# Altium schematic sheet Power.SchDoc
size B; SheetNumber: 3; SheetTotal: 12
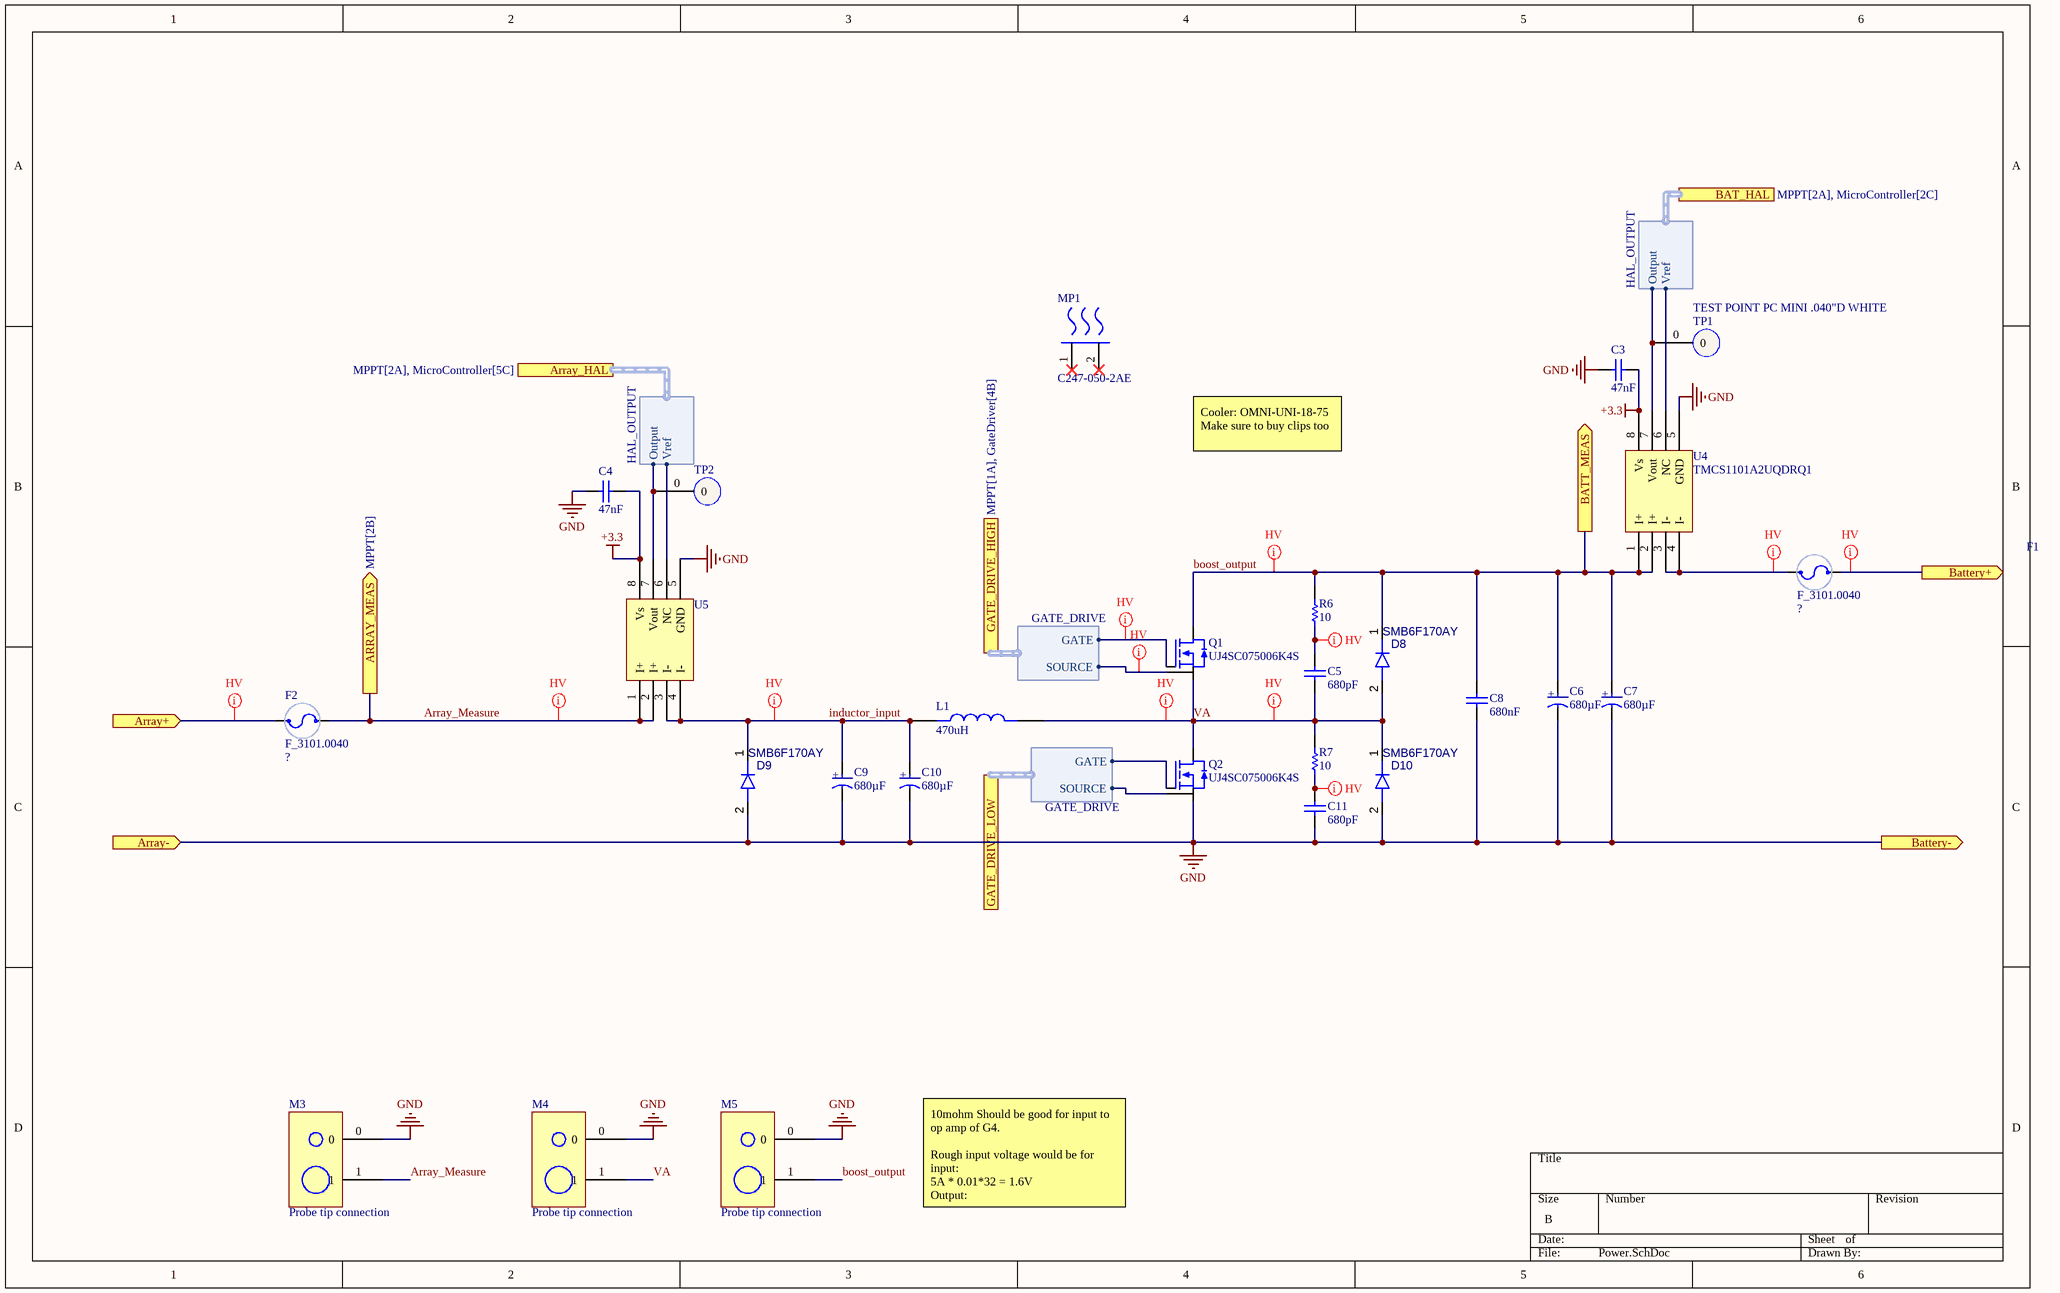
[diagram p0: Power.SchDoc]

## Parts
C3  value 47nF  [0603_CAPACITOR]  (hidden comment: C0603C473K4RECAUTO)
C4  value 47nF  [0603_CAPACITOR]  (hidden comment: C0603C473K4RECAUTO)
C5  value 680pF  [0805_Capacitor]  (hidden comment: C0805C681K2RAC7800)
C6  value 680µF  [381LR681M200J032-Footprint-1]  (hidden comment: 381LR681M200K022)
C7  value 680µF  [381LR681M200J032-Footprint-1]  (hidden comment: 381LR681M200K022)
C8  value 680nF  [684MMR400K-Footprint-1]  (hidden comment: 684MMR400K)
C9  value 680µF  [381LR681M200J032-Footprint-1]  (hidden comment: 381LR681M200K022)
C10  value 680µF  [381LR681M200J032-Footprint-1]  (hidden comment: 381LR681M200K022)
C11  value 680pF  [0805_Capacitor]  (hidden comment: C0805C681K2RAC7800)
D8  SMB6F170AY  [SMB6F170AY-Footprint-1]
D9  SMB6F170AY  [SMB6F170AY-Footprint-1]
D10  SMB6F170AY  [SMB6F170AY-Footprint-1]
F1  F_3101.0040  [F_FPG4]
F2  F_3101.0040  [F_FPG4]
L1  value 470uH  [ATCA-08-471M-H-Footprint-1]  (hidden comment: ATCA-08-471M-H)
M3  Probe tip connection  [Probe tip connection-Footprint-1]
M4  Probe tip connection  [Probe tip connection-Footprint-1]
M5  Probe tip connection  [Probe tip connection-Footprint-1]
MP1  C247-050-2AE  [FP-C247-050-2AE-MFG]
Q1  UJ4SC075006K4S  [T_TO_247_4L_UNITEDSIC - Vertical]
Q2  UJ4SC075006K4S  [T_TO_247_4L_UNITEDSIC - Vertical]
R6  value 10  [1210_Resistor]  (hidden comment: Resistor 1210 10 ohm 1%)
R7  value 10  [1210_Resistor]  (hidden comment: Resistor 1210 10 ohm 1%)
TP1  TEST POINT PC MINI .040"D WHITE  [TEST POINT 0.040" WHITE]
TP2  TEST POINT PC MINI .040"D WHITE  [TEST POINT 0.040" WHITE]  (value not drawn)
U4  TMCS1101A2UQDRQ1  [SOIC127P610X173-8N]
U5  TMCS1101A2UQDRQ1  [SOIC127P610X173-8N]  (value not drawn)

## Ports
Array+ (in, see MPPT[1B]), Array- (in, see MPPT[1B]), Array_HAL (harness HAL_OUTPUT, see MPPT[2A], MicroController[5C]), ARRAY_MEAS (out, see MPPT[2B]), BAT_HAL (harness HAL_OUTPUT, see MPPT[2A], MicroController[2C]), BATT_MEAS (out, see MPPT[2B]), Battery+ (out, see MPPT[2B]), Battery- (out, see MPPT[2B]), GATE_DRIVE_HIGH (harness GATE_DRIVE, see MPPT[1A], GateDriver[4B]), GATE_DRIVE_LOW (harness GATE_DRIVE, see MPPT[1A], GateDriver[4C])

## Harnesses
GATE_DRIVE: GATE, SOURCE
HAL_OUTPUT: Vref, Output

## Nets
+3.3: C3.2 C4.2 U4.8(Vs) U5.8(Vs)
GND: C3.1 C4.1 C6.1 C7.1 C8.1 C9.1 C10.1 C11.1 D9.2(A) D10.2(A) M3.0 M4.0 M5.0 Q2.2(S) U4.5(GND) U5.5(GND) ; port Array-, port Battery-
Array+: F2.1 ; port Array+
Array_Measure: F2.2 M3.1 U5.1(I+) U5.2(I+) ; port ARRAY_MEAS
Battery+: F1.2 ; port Battery+
boost_output: C6.2 C7.2 C8.2 D8.1(K) M5.1 Q1.1(D) R6.2 U4.1(I+) U4.2(I+) ; port BATT_MEAS
inductor_input: C9.2 C10.2 D9.1(K) L1.1 U5.3(I-) U5.4(I-)
VA: C5.1 D8.2(A) D10.1(K) L1.2 M4.1 Q1.2(S) Q2.1(D) R7.2
NetC5_2: C5.2 R6.1
NetC11_2: C11.2 R7.1
NetF1_1: F1.1 U4.3(I-) U4.4(I-)
NetQ1_3: Q1.3(K) ; port GATE_DRIVE_HIGH.SOURCE
NetQ1_4: Q1.4(G) ; port GATE_DRIVE_HIGH.GATE
NetQ2_3: Q2.3(K) ; port GATE_DRIVE_LOW.SOURCE
NetQ2_4: Q2.4(G) ; port GATE_DRIVE_LOW.GATE
NetTP1_0: TP1.0 U4.7(Vout) ; port BAT_HAL.Output
NetTP2_0: TP2.0 U5.7(Vout) ; port Array_HAL.Output
NetU4_6: U4.6(NC) ; port BAT_HAL.Vref
NetU5_6: U5.6(NC) ; port Array_HAL.Vref

Not connected (* = marked no-connect by the designer): MP1 1(MNT_1)* 2(MNT_2)*

## Layout directives
net class HV: Array+, Array_Measure, Battery+, boost_output, inductor_input, NetC5_2, NetC11_2, NetF1_1, NetQ1_3, NetQ1_4, VA

## Notes on the sheet
- Cooler: OMNI-UNI-18-75
  Make sure to buy clips too
- 10mohm Should be good for input to op amp of G4.
  Rough input voltage would be for input:
  5A * 0.01*32 = 1.6V
  Output:
  2A * 0.01*64 = 1.28
- (in symbol CMP-001-00126-3) +

## Library data of the parts
C3 C4 = CMP-001-00133-1: Ceramic Capacitor, Multilayer, Ceramic, 16V, 10% +Tol, 10% -Tol, X7R, 15% TC, 0.047uF, Surface Mount, 0603; Mounting Technology: SMD; Tolerance: 10%; Capacitor Type: Ceramic; Case/Package: 0603; Voltage Rating: 16V
C5 C11 = CMP-001-00128-1: Ceramic Capacitor, Multilayer, Ceramic, 200V, 10% +Tol, 10% -Tol, X7R, -/+15ppm/Cel TC, 0.00068uF, 0805; Case/Package: 0805; Pins: 2; Min Operating Temperature: -55°C; Capacitor Type: Ceramic; Max Operating Temperature: 125°C; Mounting Technology: SMD; Tolerance: 10%; Voltage Rating: 200V
C6 C7 C9 C10 = CMP-001-00126-3: Aluminum Electrolytic Capacitor, Polarized, Aluminum (wet), 200V, 20% +Tol, 20% -Tol, 680uF, Through Hole Mount; Ripple Current (AC): 3.45A; Capacitor Type: Aluminium; Ripple Current: 2.42A; Case/Package: Can; Mounting Technology: TH; Voltage Rating: 200V; Tolerance: 20%; Pins: 2; Min Operating Temperature: -40°C; Max Operating Temperature: 105°C
C8 = CMP-001-00127-2: Film Capacitor, Polyester, 400V, 10% +Tol, 10% -Tol, 0.68uF, Through Hole Mount; Voltage Rating: 200V; Tolerance: 10%; Max Operating Temperature: 85°C; Mounting Technology: TH; Case/Package: Bulk; Min Operating Temperature: -55°C; Pins: 2; Capacitor Type: FILM
D8-D10 = CMP-004-00044-1: TVS Diodes / ESD Suppressors Automotive 600 W, 170 V TVS in SMB Flat; Peak Inverse Voltage: 170V; Max Surge Current: 2.2A; Pins: 2; Min Operating Temperature: -55°C; Mounting Technology: SMD; Max Operating Temperature: 175°C; Case/Package: SMBflat; RoHS Compliant: Yes
F1 F2 = CMP-047-000004-2: Fuse Holder 16A 500V 1 Circuit Cartridge PCB; Manufacturer: Schurter; Voltage Rating (AC): 400V; Power Dissipation: 2.5W; Body Material: Thermoplastic; Voltage Rating (DC): 250V; Approvals: UL,CSA,VDE,IEC,SEMKO; Value: ?; Max Current: 16A; Manufacturer Part Number: 3101.0040; Min Operating Temperature: -40°C; Source: misc.SchLib; Design Item ID: F_3101.0040; Max Operating Temperature: 85°C
L1 = CMP-006-00025-8: Coustom wound inductor using 79617A7 core; Tolerance: 20%; Max Current Rating: 11A; Min Operating Temperature: 105°C; Max Operating Temperature: -40°C; Pins: 2; Mounting Technology: TH; RoHS Compliant: Yes; Case/Package: torodial; Current Rating: 11A
M3-M5 = CMP-00028-00009-3: Connection for oscilscope ground tip
MP1 = CMP-00028-00008-1: Heat Sink 2 TO-247 components; RoHS Compliant: Yes; Mounting Technology: TH; Pins: 2
Q1 Q2 = CMP-013-00040-6: 750V/6MOHM, Sic, Stacked Cascode; Manufacturer Part Number: UF3SC065007K4S; Nominal Vgs: 15V; Vgs (Max): 20V; Heatsink PN: C247-025-1AE; Vgs(th) (Max) @ Id: 15; RoHS Compliant: Yes; Transistor Type: SIC; Max Operating Temperature: 125°C; Min Operating Temperature: -40°C; Case/Package: TO247 4L; Mounting Technology: TH; Pins: 4
R6 R7 = CMP-00035-2: Res Thick Film 1210 10 Ohm 1% 1/3W ±100ppm/°C Molded SMD SMD Plastic T/R; Voltage Rating: 200V; Power: 0.5W; Footprint: 1210; Tolerance: 1%
TP1 TP2 = CMP-113-000002-1: Design Item ID: TEST POINT PC MINI .040"D WHITE; Source: Common.SchLib
U4 U5 = CMP-010-00029-1: Automotive, precision isolated current sensor with internal reference 8-SOIC -40 to 125; Max Supply Voltage: 5.5V; Min Supply Voltage: 3; Sensor Type: Hall; Nominal Supply Current: 26mA; Nominal Supply Voltage: 3.3V; Max Operating Temperature: 125°C; Min Operating Temperature: -40°C; Pins: 8; Case/Package: 8-SOIC; Mounting Technology: SMD; RoHS Compliant: Yes